# Altium schematic sheet IOport.SchDoc
size A4
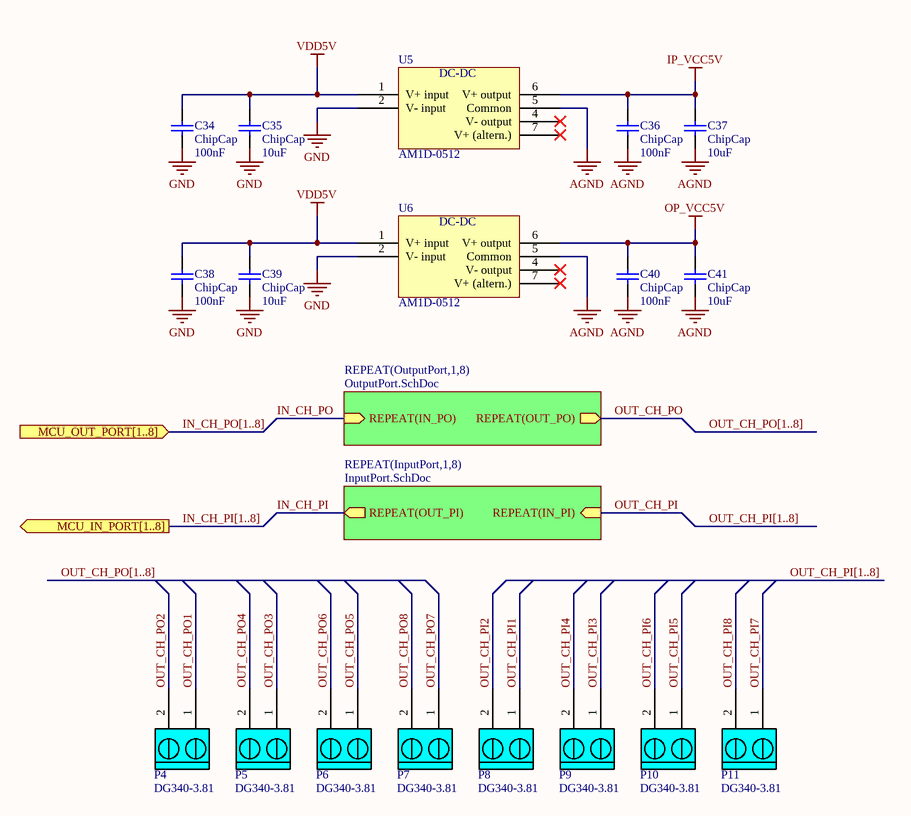
[diagram p0: IOport.SchDoc]

## Parts
C34  ChipCap  value 100nF  [CAP0805]
C35  ChipCap  value 10uF  [CAP0805]
C36  ChipCap  value 100nF  [CAP0805]
C37  ChipCap  value 10uF  [CAP0805]
C38  ChipCap  value 100nF  [CAP0805]
C39  ChipCap  value 10uF  [CAP0805]
C40  ChipCap  value 100nF  [CAP0805]
C41  ChipCap  value 10uF  [CAP0805]
P4  DG340-3.81  [DG340-3.81-02P-00A(H)]
P5  DG340-3.81  [DG340-3.81-02P-00A(H)]
P6  DG340-3.81  [DG340-3.81-02P-00A(H)]
P7  DG340-3.81  [DG340-3.81-02P-00A(H)]
P8  DG340-3.81  [DG340-3.81-02P-00A(H)]
P9  DG340-3.81  [DG340-3.81-02P-00A(H)]
P10  DG340-3.81  [DG340-3.81-02P-00A(H)]
P11  DG340-3.81  [DG340-3.81-02P-00A(H)]
U5  AM1D-0512  [SIP14]
U6  AM1D-0512  [SIP14]

## Sub-sheets
REPEAT(InputPort,1,8) = InputPort.SchDoc: REPEAT(IN_PI) (in), REPEAT(OUT_PI) (out)
REPEAT(OutputPort,1,8) = OutputPort.SchDoc: REPEAT(IN_PO) (in), REPEAT(OUT_PO) (out)

## Ports
MCU_IN_PORT[1..8] (out), MCU_OUT_PORT[1..8] (in)

## Nets
AGND: C36.1 C37.1 C40.1 C41.1 U5.5(Common) U6.5(Common)
GND: C34.1 C35.1 C38.1 C39.1 U5.2(V-_input) U6.2(V-_input)
IP_VCC5V: C36.2 C37.2 U5.6(V+_output)
OP_VCC5V: C40.2 C41.2 U6.6(V+_output)
VDD5V: C34.2 C35.2 C38.2 C39.2 U5.1(V+_input) U6.1(V+_input)
IN_CH_PI: sheet REPEAT(InputPort,1,8)/REPEAT(OUT_PI)
IN_CH_PO: sheet REPEAT(OutputPort,1,8)/REPEAT(IN_PO)
OUT_CH_PI: sheet REPEAT(InputPort,1,8)/REPEAT(IN_PI)
OUT_CH_PI1: P8.1
OUT_CH_PI2: P8.2
OUT_CH_PI3: P9.1
OUT_CH_PI4: P9.2
OUT_CH_PI5: P10.1
OUT_CH_PI6: P10.2
OUT_CH_PI7: P11.1
OUT_CH_PI8: P11.2
OUT_CH_PO: sheet REPEAT(OutputPort,1,8)/REPEAT(OUT_PO)
OUT_CH_PO1: P4.1
OUT_CH_PO2: P4.2
OUT_CH_PO3: P5.1
OUT_CH_PO4: P5.2
OUT_CH_PO5: P6.1
OUT_CH_PO6: P6.2
OUT_CH_PO7: P7.1
OUT_CH_PO8: P7.2

Not connected (* = marked no-connect by the designer): U5 4(V-_output)* 7(V+_(altern.))*; U6 4(V-_output)* 7(V+_(altern.))*

## Buses and harness runs
bus IN_CH_PI[1..8] = port MCU_IN_PORT[1..8]
bus IN_CH_PO[1..8] = port MCU_OUT_PORT[1..8]
bus OUT_CH_PI[1..8]
bus OUT_CH_PO[1..8]

## Notes on the sheet
- (in symbol AM1D-0512) DC-DC

## Library data of the parts
C34-C41 = ChipCap: Capacitor; Published: 8-Jun-2000; LatestRevisionDate: 17-Jul-2002; LatestRevisionNote: Re-released for DXP Platform.; PackageReference: RAD-0.3; Publisher: Altium Limited
P4-P11 = DG340-3.81-02P: Terminal block
U5 U6 = AM1D-0512: DC-DC 5-12V convertor